# Altium schematic sheet Sheet1.SchDoc: Panneau Projet Adam
size Letter; Author: Camille Fortin; CompanyName: Cegep Limoilou; Organization: Cegep Limoilou; Address1: 1300, 8e Avenue; Address2: Québec, QC; Address3: Canada; Address4: G1J 5L5; Revision: A; SheetNumber: 1; SheetTotal: 3; Conception: C.F.; Titre: Panneau Projet Adam; Modification: C.F.
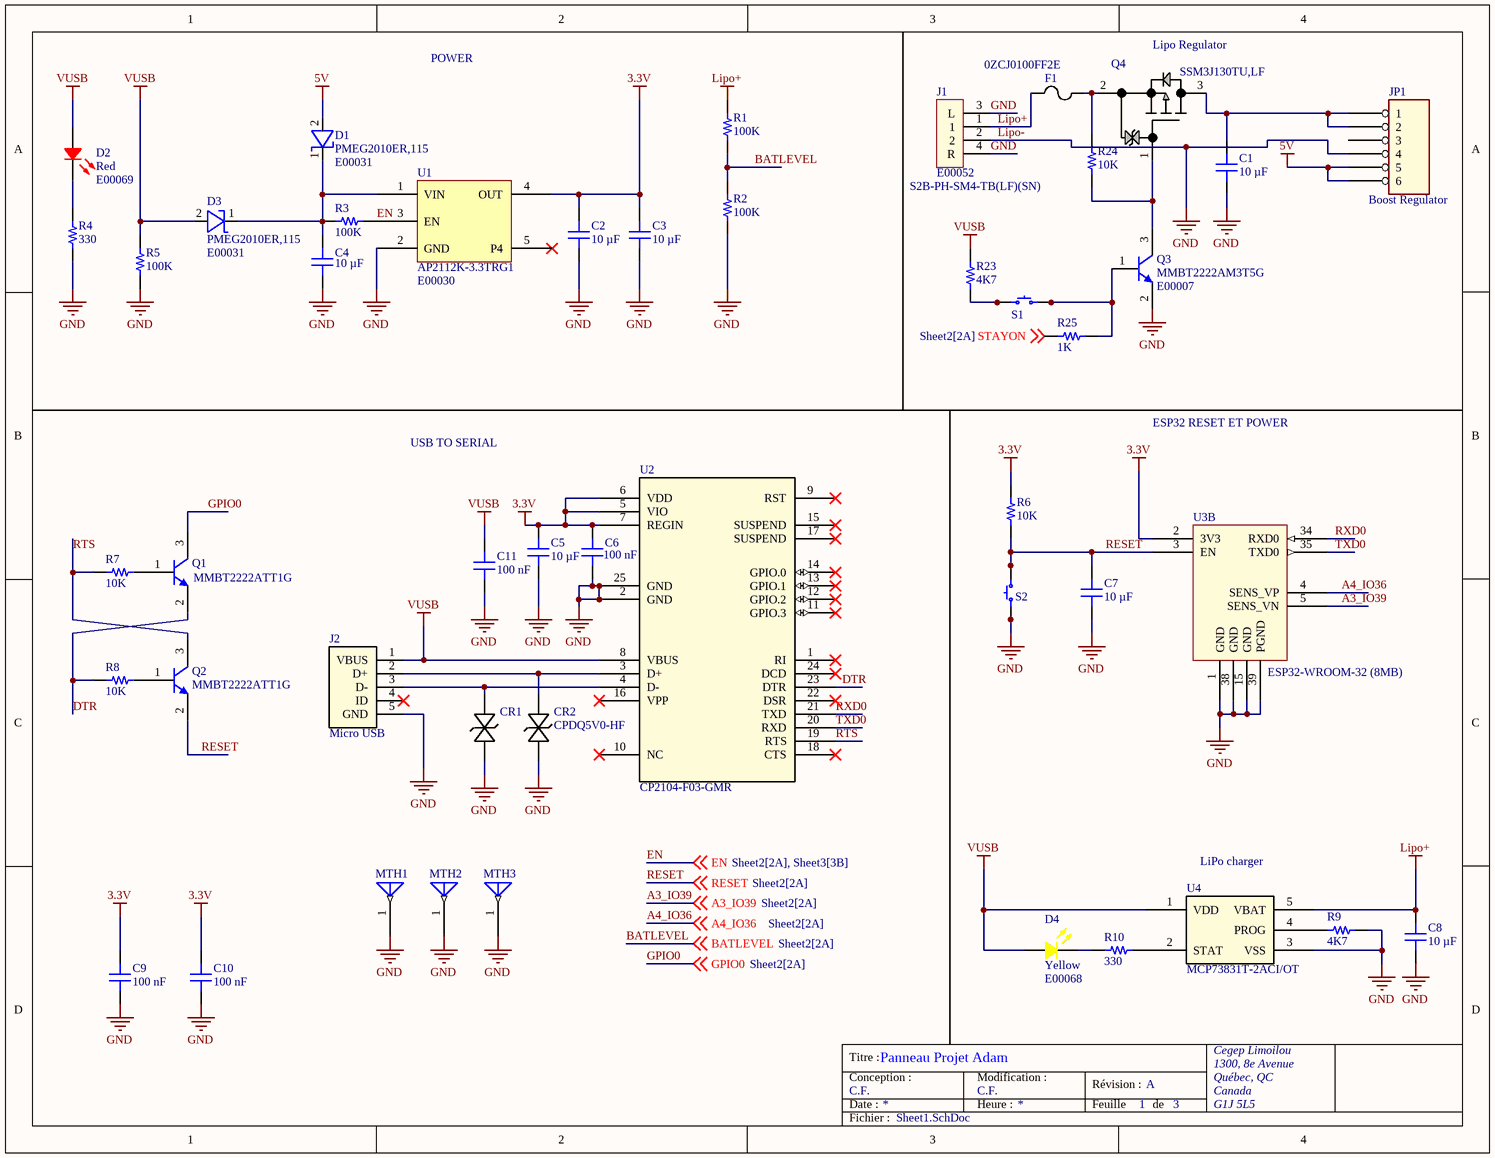
[diagram p0: Sheet1.SchDoc]

## Parts
C1  10 µF  [CAP 0603]
C2  10 µF  [CAP 0603]
C3  10 µF  [CAP 0603]
C4  10 µF  [CAP 0603]
C5  10 µF  [CAP 0603]
C6  100 nF  [CAP 0603]
C7  10 µF  [CAP 0603]
C8  10 µF  [CAP 0603]
C9  100 nF  [CAP 0603]
C10  100 nF  [CAP 0603]
C11  100 nF  [CAP 0603]
CR1  CPDQ5V0-HF  [CPDQ-M]  (value not drawn)
CR2  CPDQ5V0-HF  [CPDQ-M]
D1  PMEG2010ER,115  ADAM Inventory Number 1: E00031  [DIODE_PMEG2010ER,115_NEX]
D2  Red  ADAM Inventory Number 1: E00069  [Red Led 0603]
D3  PMEG2010ER,115  ADAM Inventory Number 1: E00031  [DIODE_PMEG2010ER,115_NEX]
D4  Yellow  ADAM Inventory Number 1: E00068  [YELLOW LED 0603 - duplicate]
F1  0ZCJ0100FF2E  [Fuse 500mA 0.6mm]
J1  ADAM Inventory Number 1: E00052  Supplier Part Number 1: S2B-PH-SM4-TB(LF)(SN)  [S2B-PH-SM4-TB_LF__SN]  (hidden comment: CONN JST 2P SM 90DEG)
J2  Micro USB  [CONN_1050170001_MOL]
JP1  Boost Regulator  [HDR1X6]
MTH1  NTENNA  [Mounting Hole]  (value not drawn)
MTH2  ANTENNA  [Mounting Hole]  (value not drawn)
MTH3  ANTENNA  [Mounting Hole]  (value not drawn)
Q1  MMBT2222ATT1G  [SOT-416_1P65X0P9_ONS-M]
Q2  MMBT2222ATT1G  [SOT-416_1P65X0P9_ONS-M]
Q3  MMBT2222AM3T5G  ADAM Inventory Number 1: E00007  [SOT_4C-E3-08_VIS-M]
Q4  SSM3J130TU,LF  [UFM_TOS]
R1  100K  [RES 0603]
R2  100K  [RES 0603]
R3  100K  [RES 0603]
R4  330  [RES 0603]
R5  100K  [RES 0603]
R6  10K  [RES 0603]
R7  10K  [RES 0603]
R8  10K  [RES 0603]
R9  4K7  [RES 0603]
R10  330  [RES 0603]
R23  4K7  [RES 0603]
R24  10K  [RES 0603]
R25  1K  [RES 0603]
S1  KMR741NG ULC LFS  [Switch Lin SMD]  (value not drawn)
S2  KMR741NG ULC LFS  [Switch Lin SMD]  (value not drawn)
U1  AP2112K-3.3TRG1  ADAM Inventory Number 1: E00030  [AP2112R5-3.3TRG1_DIO]
U2  CP2104-F03-GMR  [QFN_F03-GMR_SIL-M]
U3  ESP32-WROOM-32 (8MB)  [ESP32-WROOM-32D]  (part B of 3)
U4  MCP73831T-2ACI/OT  [SOT23_MCP73831T-2ACI/OT_HNW]

## Nets
3.3V: C2.2 C3.2 C5.2 C6.2 C9.2 C10.2 R6.2 U1.4(OUT) U2.5(VIO) U2.6(VDD) U2.7(REGIN) U3.2(3V3)
5V: D1.2(A) JP1.5 JP1.6
GND: C1.1 C2.1 C3.1 C4.1 C5.1 C6.1 C7.1 C8.1 C9.1 C10.1 C11.1 CR1.1 CR2.1 J1.2 J1.3(L) J1.4(R) J2.5(GND) JP1.4 MTH1.1 MTH2.1 MTH3.1 Q3.2(E) R2.1 R4.2 R5.1 R9.2 S2.1 S2.2 U1.2(GND) U2.2(GND) U2.25(GND) U3.1(GND) U3.15(GND) U3.38(GND) U3.39(PGND) U4.3(VSS)  [also labelled Lipo-]
Lipo+: C8.2 F1.1 J1.1 R1.2 U4.5(VBAT)
VUSB: C11.2 D2.1 D3.2(A) D4.1 J2.1(VBUS) R5.2 R23.2 U2.8(VBUS) U4.1(VDD)
A3_IO39: U3.5(SENS_VN) ; off-sheet A3_IO39
A4_IO36: U3.4(SENS_VP) ; off-sheet A4_IO36
BATLEVEL: R1.1 R2.2 ; off-sheet BATLEVEL
DTR: Q1.2(E) R8.2 U2.23(DTR)
EN: R3.1 U1.3(EN) ; off-sheet EN
GPIO0: Q1.3(C) ; off-sheet GPIO0
RESET: C7.2 Q2.2(E) R6.1 S2.3 S2.4 U3.3(EN) ; off-sheet RESET
RTS: Q2.3(C) R7.2 U2.19(RTS)
RXD0: U2.21(TXD) U3.34(RXD0)
STAYON: R25.2 ; off-sheet STAYON
TXD0: U2.20(RXD) U3.35(TXD0)
NetC1_2: C1.2 JP1.1 JP1.2 Q4.3
NetC4_2: C4.2 D1.1(K) D3.1(K) R3.2 U1.1(VIN)
NetCR1_2: CR1.2 J2.3(D-) U2.4(D-)
NetCR2_2: CR2.2 J2.2(D+) U2.3(D+)
NetD2_2: D2.2 R4.1
NetD4_2: D4.2 R10.1
NetF1_2: F1.2 Q4.2 R24.2
NetQ1_1: Q1.1(B) R7.1
NetQ2_1: Q2.1(B) R8.1
NetQ3_1: Q3.1(B) R25.1 S1.3 S1.4
NetQ3_3: Q3.3(C) Q4.1 R24.1
NetR9_1: R9.1 U4.4(PROG)
NetR10_2: R10.2 U4.2(STAT)
NetR23_1: R23.1 S1.1 S1.2

Not connected (* = marked no-connect by the designer): J2 4(ID)*; JP1 3; U1 5(P4)*; U2 1(RI)* 9(RST)* 10(NC)* 11(GPIO.3)* 12(GPIO.2)* 13(GPIO.1)* 14(GPIO.0)* 15(SUSPEND)* 16(VPP)* 17(SUSPEND)* 18(CTS)* 22(DSR)* 24(DCD)*

## Notes on the sheet
- POWER
- (near Q4) Lipo Regulator
- ESP32 RESET ET POWER
- USB TO SERIAL
- (near U4) LiPo charger
- Titre :
- Conception :
- Date :
- Modification :
- Heure :
- Révision :
- Feuille
- de
- Fichier :

## Library data of the parts
C1-C5 C7 C8 = GRM188C81A106MA73D: CAP CER 10UF 10V X6S 0603; manufacturer: Murata Electronics; Tolerance: ±20%; Part Number: GRM188C81A106MA73D; Value: 10 µF; Applications: General Purpose; Capacitance: 10 µF; componentlink1description: Datasheet; componentlink1url: https://www.murata.com/~/media/webrenewal/support/library/catalog/products/capacitor/mlcc/c02e.ashx?la=en-us; componentlink2description: DigiKey Link; componentlink2url: https://www.digikey.com/en/products/detail/murata-electronics/GRM188C81A106MA73D/3900461; Device Package: 0603 (1608 Metric); lastupdated: 2023-03-27 19:07:26; Lifecycle Status: Active; Minimum Order: 1; Mounting Type: Surface Mount, MLCC; Operating Temperature: -55°C ~ 105°C; Package / Case: 0603 (1608 Metric); packaging: TapeAndReel; partid: 2456; Part Status: Active; price: 0.04; series: GRM; Size / Dimension: 0.063" L x 0.031" W (1.60mm x 0.80mm); Supplier 1: DigiKey; Supplier Part Number 1: 490-7197-1-ND; Temperature Coefficient: X6S; Thickness (Max): 0.039" (1.00mm); Voltage - Rated: 10V; Manufacturer Part Number 1: GRM188C81A106MA73D
C6 C9-C11 = GRM188C81A106MA73D: CAP CER 10UF 10V X6S 0603; manufacturer: Murata Electronics; Capacitance: 10 µF; Tolerance: ±20%; Part Number: GRM188C81A106MA73D; Value: 100 nF; Applications: General Purpose; componentlink1description: Datasheet; componentlink1url: https://www.murata.com/~/media/webrenewal/support/library/catalog/products/capacitor/mlcc/c02e.ashx?la=en-us; componentlink2description: DigiKey Link; componentlink2url: https://www.digikey.com/en/products/detail/murata-electronics/GRM188C81A106MA73D/3900461; Device Package: 0603 (1608 Metric); lastupdated: 2023-03-27 19:07:26; Lifecycle Status: Active; Minimum Order: 1; Mounting Type: Surface Mount, MLCC; Operating Temperature: -55°C ~ 105°C; Package / Case: 0603 (1608 Metric); packaging: TapeAndReel; partid: 2456; Part Status: Active; price: 0.04; series: GRM; Size / Dimension: 0.063" L x 0.031" W (1.60mm x 0.80mm); Supplier 1: DigiKey; Supplier Part Number 1: 490-7197-1-ND; Temperature Coefficient: X6S; Thickness (Max): 0.039" (1.00mm); Voltage - Rated: 10V; Manufacturer Part Number 1: GRM188C81A106MA73D
CR1 CR2 = CPDQ5V0-HF: Diode TVS bidirectionnel; Mfr_Name: Comchip
D1 D3 = PMEG2010ER,115: Diode shotkey; Manufacturer Part Number 1: PMEG2010ER115; Supplier 1: Digi-Key; Supplier Part Number 1: 1727-5192-1-ND
D2 = 0603 RED LED: Manufacturer Part Number 1: BL-HUB36A-AV-TRB; Manufacturer: American Bright Optoelectronics Corporation; Configuration: Standard; Current - Test: 20mA; Lens Color: Colorless; Lens Style: Rectangle with Flat Top; Lens Transparency: Clear; Millicandela Rating: 94mcd; Viewing Angle: 120°; Voltage - Forward (Vf) (Typ): 2.2V; Wavelength - Dominant: 632nm; Wavelength - Peak: 645nm; Color: Red; ComponentLink1Description: Datasheet; ComponentLink1URL: https://americanbrightled.com/pdffiles/smt/BL-HUB36A-AV-TRB.pdf; ComponentLink2Description: DigiKey Link; ComponentLink2URL: https://www.digikey.com/en/products/detail/american-bright-optoelectronics-corporation/BL-HUB36A-AV-TRB/9678174; Device Package: 0603 (1608 Metric); Height (Max): 0.70mm; LastUpdated: 2023-03-27 19:53:19; Lifecycle Status: Active; Minimum Order: 1; Mounting Type: Surface Mount; Package / Case: 0603 (1608 Metric); Packaging: TapeAndReel; PartId: 1020; Part Status: Active; Price: 0.04; Series: -; Size / Dimension: 1.60mm L x 0.80mm W; Supplier 1: DigiKey; Supplier Part Number 1: BL-HUB36A-AV-TRBCT-ND; Supplier Device Package: 0603; Value: Red
D4 = 0603 YELLOW LED: 0603 YELLOW; Manufacturer Part Number 1: BL-HKC36D-AV-TRB; Manufacturer: American Bright Optoelectronics Corporation; Configuration: 0603; Current - Test: 20mA; Lens Color: Colorless; Lens Size: 0.87mm x 0.80mm; Lens Style: Rectangle with Flat Top; Lens Transparency: Clear; Millicandela Rating: 120mcd; Viewing Angle: 120°; Voltage - Forward (Vf) (Typ): 2V; Wavelength - Dominant: 589nm; Wavelength - Peak: 590nm; Color: Yellow; ComponentLink1Description: Datasheet; ComponentLink1URL: http://americanbrightled.com/pdffiles/smt/BL-HKC36D-AV-TRB.pdf; ComponentLink2Description: DigiKey Link; ComponentLink2URL: https://www.digikey.com/en/products/detail/american-bright-optoelectronics-corporation/BL-HKC36D-AV-TRB/9678175; Device Package: 0603 (1608 Metric); Height (Max): 0.85mm; LastUpdated: 2023-03-27 19:54:01; Lifecycle Status: Active; Minimum Order: 1; Mounting Type: Surface Mount; Package / Case: 0603 (1608 Metric); Packaging: TapeAndReel; PartId: 82; Part Status: Active; Price: 0.04; Series: -; Size / Dimension: 1.60mm L x 0.80mm W; Supplier 1: DigiKey; Supplier Part Number 1: BL-HKC36D-AV-TRBCT-ND; Supplier Device Package: 0603; Value: Yellow
F1 = NANOSMDCH030F/24-02: No Description Available; Mfr_Name: Littelfuse Inc
J1 = CONN JST 2P SM 90DEG: CONN SM JST 2P; Copyright: Copyright (C) 2023 Ultra Librarian. All rights reserved.; Mfr_Name: JST; Manufacturer Part Number 1: S2B-PH-SM4-TB(LF)(SN); RefDes: RefDes; Type: DEV; Supplier 1: Arrow Electronics; Parameter 1: *
J2 = 1050170001: No Description Available; Mfr_Name: Molex Connector Corporation; Copyright: Copyright (C) 2023 Ultra Librarian. All rights reserved.; RefDes: RefDes; Type: DEV; Manufacturer Part Number 1: 1050170001
JP1 = HEADER 6
MTH1 = ANTENNA
Q1 Q2 = MMBT2222ATT1G: TRANS NPN 40V 0.6A SC75-3; Manufacturer: ON Semiconductor; Current - Collector (Ic) (Max): 600mA; DC Current Gain (hFE) (Min) @ Ic, Vce: 100 @ 150mA, 10V; Frequency - Transition: 300MHz; Power - Max: 150mW; Vce Saturation (Max) @ Ib, Ic: 1V @ 50mA, 500mA; Part Number: MMBT2222ATT1G; ComponentLink1Description: Datasheet; ComponentLink1URL: http://www.onsemi.com/pub/Collateral/MMBT2222ATT1-D.PDF; ComponentLink2Description: DigiKey Link; ComponentLink2URL: http://digikey.com/product-detail/en/on-semiconductor/MMBT2222ATT1G/MMBT2222ATT1GOSCT-ND/1967146; LastUpdated: 2023-03-27 20:07:05; Lifecycle Status: Active; Minimum Order: 1; Mounting Type: Surface Mount; Operating Temperature: -55°C ~ 150°C (TJ); Package / Case: SC-75, SOT-416; Packaging: TapeAndReel; PartId: 32; Part Status: Active; Price: 0.02; Series: -; Supplier 1: DigiKey; Supplier Part Number 1: MMBT2222ATT1GOSCT-ND; Supplier Device Package: SC-75, SOT-416; Transistor Type: NPN; Voltage - Collector Emitter Breakdown (Max): 40V; Manufacturer Part Number 1: MMBT2222ATT1G
Q3 = TRANS NPN 40V: TRANS NPN 40V 0.6A SOT-723; Manufacturer: ON Semiconductor; Current - Collector Cutoff (Max): 10nA (ICBO); Current - Collector (Ic) (Max): 600mA; DC Current Gain (hFE) (Min) @ Ic, Vce: 100 @ 150mA, 10V; Frequency - Transition: 300MHz; Power - Max: 640mW; Vce Saturation (Max) @ Ib, Ic: 1V @ 50mA, 500mA; Manufacturer Part Number 1: MMBT2222AM3T5G; ComponentLink1Description: Datasheet; ComponentLink1URL: http://www.onsemi.com/pub/Collateral/MMBT2222AM3-D.PDF; ComponentLink2Description: DigiKey Link; ComponentLink2URL: http://digikey.com/product-detail/en/on-semiconductor/MMBT2222AM3T5G/MMBT2222AM3T5GOSCT-ND/3487571; LastUpdated: 2023-03-28 20:16:11; Lifecycle Status: Active; Minimum Order: 1; Mounting Type: Surface Mount; Operating Temperature: -55°C ~ 150°C (TJ); Package / Case: SOT-723; Packaging: TapeAndReel; PartId: 22; Part Status: Active; Price: 0.03; Series: -; Supplier 1: DigiKey; Supplier Part Number 1: MMBT2222AM3T5GOSCT-ND; Supplier Device Package: SOT-723; Transistor Type: NPN; Voltage - Collector Emitter Breakdown (Max): 40V
Q4 = SSM3J130TU,LF: No Description Available; Mfr_Name: Toshiba Electronic Devices & Storage Corp.; RefDes: Refdes; Type: Type
R1-R3 R5 R23-R25 = CPF0603B100KE: RES SMD 100K OHM 0.1% 1/16W 0603; Manufacturer: TE Connectivity Passive Product; Power (Watts): 0.063W, 1/16W; Resistance: 100 kOhms; Temperature Coefficient: ±25ppm/°C; Part Number: CPF0603B100KE; ComponentLink1Description: Datasheet; ComponentLink1URL: https://www.te.com/commerce/DocumentDelivery/DDEController?Action=srchrtrv&DocNm=1773200&DocType=DS&DocLang=English; ComponentLink2Description: DigiKey Link; ComponentLink2URL: https://www.digikey.com/en/products/detail/te-connectivity-passive-product/CPF0603B100KE/2381864; Composition: Thin Film; Device Package: 0603 (1608 Metric); Height - Seated (Max): 0.022" (0.55mm); LastUpdated: 2023-03-22 19:30:13; Lifecycle Status: Active; Minimum Order: 1; Number of Terminations: 2; Operating Temperature: -55°C ~ 155°C; Package / Case: 0603 (1608 Metric); Packaging: TapeAndReel; PartId: 4883; Part Status: Active; Price: 0.09; Series: CPF, Neohm; Size / Dimension: 0.061" L x 0.031" W (1.55mm x 0.80mm); Supplier 1: DigiKey; Supplier Part Number 1: A119912CT-ND; Supplier Device Package: 0603; Tolerance: ±0.1%; Manufacturer Part Number 1: CPF0603B100KE
  R1-R3 R5: Value: 100K
  R23: Value: 4K7
  R24: Value: 10K
  R25: Value: 1K
R4 R10 = CPF0603B1K0E: RES SMD 1K OHM 0.1% 1/16W 0603; Manufacturer: TE Connectivity Passive Product; Power (Watts): 0.063W, 1/16W; Resistance: 1 kOhms; Temperature Coefficient: ±25ppm/°C; Part Number: CPF0603B1K0E; Value: 330; ComponentLink1Description: Datasheet; ComponentLink1URL: https://www.te.com/commerce/DocumentDelivery/DDEController?Action=srchrtrv&DocNm=1773200&DocType=DS&DocLang=English; ComponentLink2Description: DigiKey Link; ComponentLink2URL: https://www.digikey.com/en/products/detail/te-connectivity-passive-product/CPF0603B1K0E/2390473; Composition: Thin Film; Device Package: 0603 (1608 Metric); Height - Seated (Max): 0.022" (0.55mm); LastUpdated: 2023-03-28 19:30:06; Lifecycle Status: Active; Minimum Order: 1; Number of Terminations: 2; Operating Temperature: -55°C ~ 155°C; Package / Case: 0603 (1608 Metric); Packaging: TapeAndReel; PartId: 4877; Part Status: Active; Price: 0.09; Series: CPF, Neohm; Size / Dimension: 0.061" L x 0.031" W (1.55mm x 0.80mm); Supplier 1: DigiKey; Supplier Part Number 1: A119887CT-ND; Supplier Device Package: 0603; Tolerance: ±0.1%; Manufacturer Part Number 1: CPF0603B1K0E
R6-R8 = RNCS0603BKE10K0: RES 10K OHM 0.1% 1/16W 0603; Manufacturer: Stackpole Electronics Inc; Power (Watts): 0.063W, 1/16W; Resistance: 10 kOhms; Temperature Coefficient: ±25ppm/°C; Part Number: RNCS0603BKE10K0; Value: 10K; ComponentLink1Description: Datasheet; ComponentLink1URL: https://www.seielect.com/catalog/sei-rncs_rnch.pdf; ComponentLink2Description: DigiKey Link; ComponentLink2URL: https://www.digikey.com/en/products/detail/stackpole-electronics-inc/RNCS0603BKE10K0/1708836; Composition: Thin Film; Device Package: 0603 (1608 Metric); Features: Anti-Corrosive, Automotive AEC-Q200, Moisture Resistant; Height - Seated (Max): 0.022" (0.55mm); LastUpdated: 2023-03-27 19:26:50; Lifecycle Status: Active; Minimum Order: 1; Number of Terminations: 2; Operating Temperature: -55°C ~ 155°C; Package / Case: 0603 (1608 Metric); Packaging: TapeAndReel; PartId: 4838; Part Status: Active; Price: 0.07; Ratings: AEC-Q200; Series: RNCS; Size / Dimension: 0.061" L x 0.031" W (1.55mm x 0.80mm); Supplier 1: DigiKey; Supplier Part Number 1: RNCS0603BKE10K0CT-ND; Supplier Device Package: 0603; Tolerance: ±0.1%; Manufacturer Part Number 1: RNCS0603BKE10K0
R9 = RT0603FRE074K7L: RES SMD 4.7K OHM 1% 1/10W 0603; Manufacturer: Yageo; Power (Watts): 0.1W, 1/10W; Resistance: 4.7 kOhms; Temperature Coefficient: ±50ppm/°C; Part Number: RT0603FRE074K7L; Value: 4K7; ComponentLink1Description: Datasheet; ComponentLink1URL: https://www.yageo.com/upload/media/product/productsearch/datasheet/rchip/PYu-RT_1-to-0.01_RoHS_L_11.pdf; ComponentLink2Description: DigiKey Link; ComponentLink2URL: https://www.digikey.com/en/products/detail/yageo/RT0603FRE074K7L/1075404; Composition: Thin Film; Device Package: 0603 (1608 Metric); Height - Seated (Max): 0.022" (0.55mm); LastUpdated: 2023-03-28 19:30:03; Lifecycle Status: Active; Minimum Order: 1; Number of Terminations: 2; Operating Temperature: -55°C ~ 155°C; Package / Case: 0603 (1608 Metric); Packaging: TapeAndReel; PartId: 5678; Part Status: Active; Price: 0.01; Series: RT; Size / Dimension: 0.063" L x 0.031" W (1.60mm x 0.80mm); Supplier 1: DigiKey; Supplier Part Number 1: YAG1238CT-ND; Supplier Device Package: 0603; Tolerance: ±1%; Manufacturer Part Number 1: RT0603FRE074K7L
S1 S2 = KMR741NG ULC LFS: SWITCH TACTILE SPST-NO 50MA 32V; Manufacturer: C&K; Actuator Height off PCB, Vertical: 2.50mm; Actuator Orientation: Top Actuated; Actuator Type: Standard; Contact Rating @ Voltage: 0.05A @ 32VDC; Illumination: Non-Illuminated; Ingress Protection: IP67 - Dust Tight, Waterproof; Operating Force: 400gf; Outline: 4.20mm x 2.80mm; Switch Function: Off-Mom; Part Number: KMR741NG ULC LFS; Circuit: SPST-NO; ComponentLink1Description: Datasheet; ComponentLink1URL: https://dznh3ojzb2azq.cloudfront.net/products/Tactile/KMR7/documents/datasheet.pdf; ComponentLink2Description: DigiKey Link; ComponentLink2URL: http://digikey.com/product-detail/en/c-k/KMR741NG-ULC-LFS/CKN10688CT-ND/6035360; LastUpdated: 2020-04-09 10:01:05; Lifecycle Status: Active; Minimum Order: 1; Mounting Type: Surface Mount; Operating Temperature: -40°C ~ 85°C; Packaging: TapeAndReel; Part Status: Active; Price: 0.16; Series: KMR7; Supplier 1: DigiKey; Supplier Part Number 1: CKN10688CT-ND; Termination Style: Gull Wing; Manufacturer Part Number 1: KMR741NG ULC LFS
U1 = REG LIN 3.3V: REG LINEAIRE 3.3V; Manufacturer Part Number 1: AP2112K-3.3TRG1; Supplier 1: Future Electronics; Supplier Part Number 1: 8043011
U2 = CP2104-F03-GMR: No Description Available; Mfr_Name: Silicon Labs; Copyright: Copyright (C) 2023 Ultra Librarian. All rights reserved.; RefDes: RefDes; Type: DEV; Manufacturer Part Number 1: CP2104-F03-GMR
U3 = ESP32-WROOM-32 (8MB): No Description Available; Mfr_Name: Espressif Systems; Copyright: Copyright (C) 2023 Ultra Librarian. All rights reserved.; RefDes: RefDes; Type: DEV; Manufacturer Part Number 1: ESP32-WROOM-32 (8MB)
U4 = MCP73831T-2ACI/OT: No Description Available; Mfr_Name: Honeywell; Copyright: Copyright (C) 2023 Ultra Librarian. All rights reserved.; RefDes: RefDes; Type: DEV; Manufacturer Part Number 1: MCP73831T-2ACI/OT